# EAGLE schematic design_block_rev3.4 (EAGLE 9.3.0)
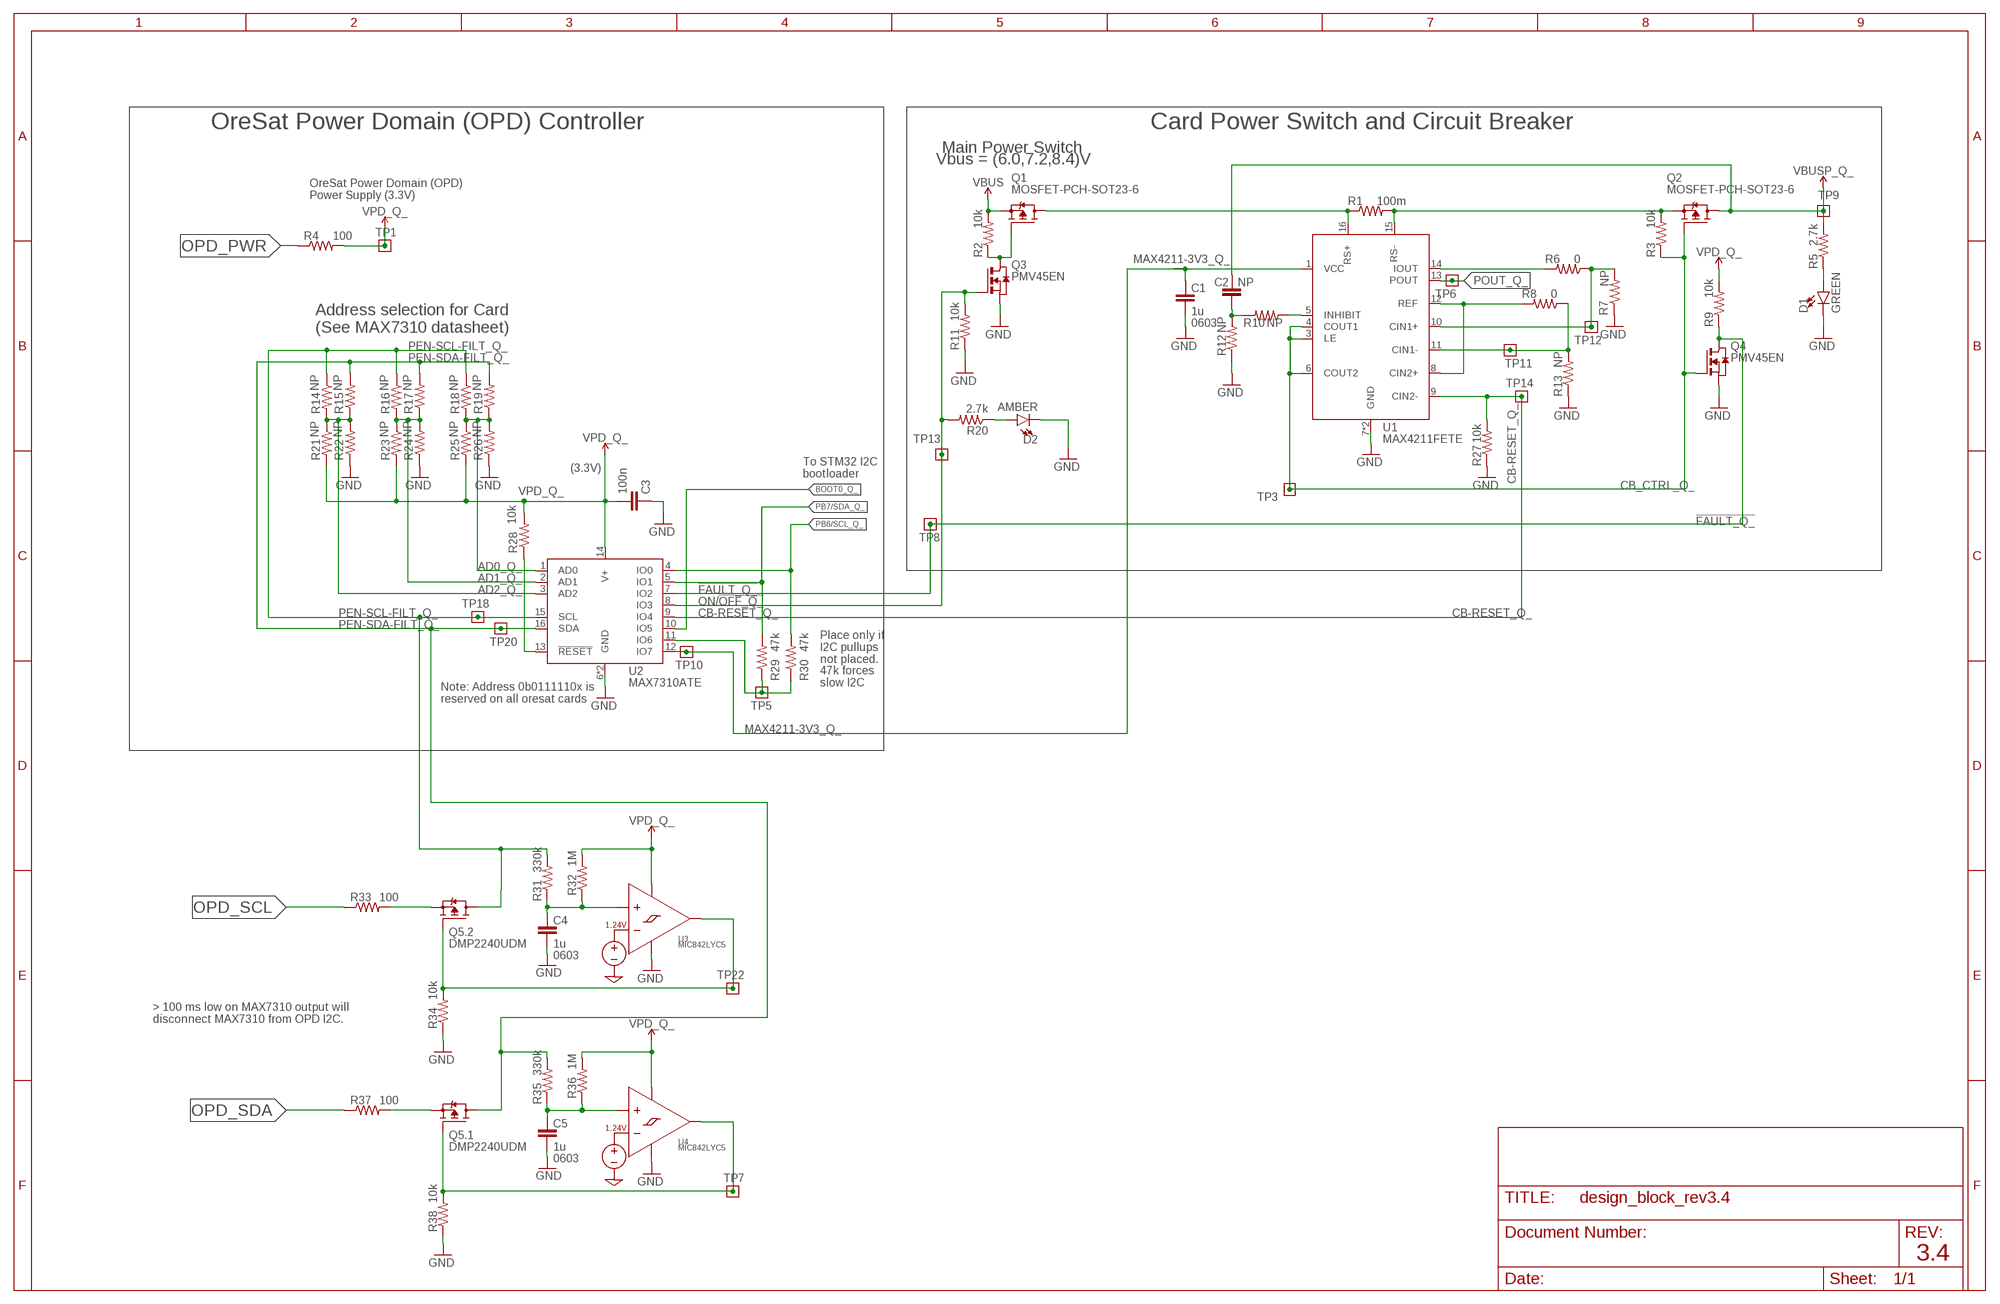
[diagram p0: schematic, sheet 1]

## Parts
C1  1u  C-EU0603-B-NOSILK  [.0603-B-NOSILK]
C2  NP  C-EU0402-B-NOSILK  [.0402-B-NOSILK]
C3  100n  C-EU0402-B-NOSILK  [.0402-B-NOSILK]
C4  1u  C-EU0603-B-NOSILK  [.0603-B-NOSILK]
C5  1u  C-EU0603-B-NOSILK  [.0603-B-NOSILK]
D1  GREEN  LED-GREEN0603  [LED-0603]
D2  AMBER  LED-GREEN0603  [LED-0603]
Q1  MOSFET-PCH-SOT23-6  [SOT23-6]
Q2  MOSFET-PCH-SOT23-6  [SOT23-6]
Q3  PMV45EN  [SOT23]
Q4  PMV45EN  [SOT23]
Q5  DMP2240UDM  MOSFET-PCH-SOT23-6  [SOT23-6]
R1  100m  R-US_R1206  [R1206]
R2  10k  R-US_0402-B-NOSILK  [.0402-B-NOSILK]
R3  10k  R-US_0402-B-NOSILK  [.0402-B-NOSILK]
R4  100  R-US_0402-B-NOSILK  [.0402-B-NOSILK]
R5  2.7k  R-US_0402-B-NOSILK  [.0402-B-NOSILK]
R6  0  R-US_0402-B-NOSILK  [.0402-B-NOSILK]
R7  NP  R-US_0402-B-NOSILK  [.0402-B-NOSILK]
R8  0  R-US_0402-B-NOSILK  [.0402-B-NOSILK]
R9  10k  R-US_0402-B-NOSILK  [.0402-B-NOSILK]
R10  NP  R-US_0402-B-NOSILK  [.0402-B-NOSILK]
R11  10k  R-US_0402-B-NOSILK  [.0402-B-NOSILK]
R12  NP  R-US_0402-B-NOSILK  [.0402-B-NOSILK]
R13  NP  R-US_0402-B-NOSILK  [.0402-B-NOSILK]
R14  NP  R-US_0402-B-NOSILK  [.0402-B-NOSILK]
R15  NP  R-US_0402-B-NOSILK  [.0402-B-NOSILK]
R16  NP  R-US_0402-B-NOSILK  [.0402-B-NOSILK]
R17  NP  R-US_0402-B-NOSILK  [.0402-B-NOSILK]
R18  NP  R-US_0402-B-NOSILK  [.0402-B-NOSILK]
R19  NP  R-US_0402-B-NOSILK  [.0402-B-NOSILK]
R20  2.7k  R-US_0402-B-NOSILK  [.0402-B-NOSILK]
R21  NP  R-US_0402-B-NOSILK  [.0402-B-NOSILK]
R22  NP  R-US_0402-B-NOSILK  [.0402-B-NOSILK]
R23  NP  R-US_0402-B-NOSILK  [.0402-B-NOSILK]
R24  NP  R-US_0402-B-NOSILK  [.0402-B-NOSILK]
R25  NP  R-US_0402-B-NOSILK  [.0402-B-NOSILK]
R26  NP  R-US_0402-B-NOSILK  [.0402-B-NOSILK]
R27  10k  R-US_0402-B-NOSILK  [.0402-B-NOSILK]
R28  10k  R-US_0402-B-NOSILK  [.0402-B-NOSILK]
R29  47k  R-US_0402-B-NOSILK  [.0402-B-NOSILK]
R30  47k  R-US_0402-B-NOSILK  [.0402-B-NOSILK]
R31  330k  R-US_0402-B-NOSILK  [.0402-B-NOSILK]
R32  1M  R-US_0402-B-NOSILK  [.0402-B-NOSILK]
R33  100  R-US_0402-B-NOSILK  [.0402-B-NOSILK]
R34  10k  R-US_0402-B-NOSILK  [.0402-B-NOSILK]
R35  330k  R-US_0402-B-NOSILK  [.0402-B-NOSILK]
R36  1M  R-US_0402-B-NOSILK  [.0402-B-NOSILK]
R37  100  R-US_0402-B-NOSILK  [.0402-B-NOSILK]
R38  10k  R-US_0402-B-NOSILK  [.0402-B-NOSILK]
TP1  TEST-POINT  [2MM-TEST-POINT]
TP3  TEST-POINT  [2MM-TEST-POINT]
TP5  TEST-POINT  [2MM-TEST-POINT]
TP6  TEST-POINT  [2MM-TEST-POINT]
TP7  TEST-POINT  [2MM-TEST-POINT]
TP8  TEST-POINT  [2MM-TEST-POINT]
TP9  TEST-POINT  [2MM-TEST-POINT]
TP10  TEST-POINT  [2MM-TEST-POINT]
TP11  TEST-POINT  [2MM-TEST-POINT]
TP12  TEST-POINT  [2MM-TEST-POINT]
TP13  TEST-POINT  [2MM-TEST-POINT]
TP14  TEST-POINT  [2MM-TEST-POINT]
TP18  TEST-POINT  [2MM-TEST-POINT]
TP20  TEST-POINT  [2MM-TEST-POINT]
TP22  TEST-POINT  [2MM-TEST-POINT]
U1  MAX4211FETE  MAX4211  [QFN65P400X400X80-17T210]
U2  MAX7310ATE  MAX7310  [QFN65P400X400X80-17T210]
U3  MIC842LYC5  [SC70-5]
U4  MIC842LYC5  [SC70-5]

## Nets
!FAULT_Q_: Q4.3(D) R9.1 TP8.1 U2.7(IO2)
AD0_Q_: R18.2 R19.1 R25.1 R26.2 U2.1(AD0)
AD1_Q_: R16.2 R17.1 R23.1 R24.2 U2.2(AD1)
AD2_Q_: R14.2 R15.1 R21.1 R22.2 U2.3(AD2)
BOOT0_Q_: U2.10(IO5)
CB-RESET_Q_: R27.2 TP14.1 U1.9(CIN2-) U2.9(IO4)
CB_CTRL_Q_: Q2.3(G) Q4.1(G) R3.1 TP3.1 U1.3(LE) U1.4(COUT1) U1.6(COUT2)
GND: C1.2 C3.1 C4.2 C5.2 D1.C D2.C Q3.2(S) Q4.2(S) R7.1 R11.1 R12.1 R13.1 R22.1 R24.1 R26.1 R27.1 R34.1 R38.1 U1.7(GND) U1.EPAD(GND) U2.6(GND) U2.EPAD(GND) U3.2(GND) U4.2(GND)
IOUT_Q_: R6.2 U1.14(IOUT)
MAX4211-3V3_Q_: C1.1 TP10.1 U1.1(VCC) U2.12(IO7)
N$270: D1.A R5.1
N$385: R29.1 R30.1 TP5.1 U2.11(IO6)
N$398: Q2.4(S) R1.2 R3.2 U1.15(RS-)
N$400: C4.1 R31.1 R32.1 U3.1(INP)
N$401: C5.1 R35.1 R36.1 U4.1(INP)
N$479: Q5.2(.2:S) R33.2
N$480: Q5.3(.2:G) R34.2 TP22.1 U3.4(OUT)
N$575: D2.A R20.1
N$579: Q5.5(.1:S) R37.2
N$580: Q5.1(.1:G) R38.2 TP7.1 U4.4(OUT)
N$589: R28.1 U2.13(!RESET)
N$590: Q1.3(G) Q3.3(D) R2.1
N$593: Q1.1(D) Q1.2(D) Q1.5(D) Q1.6(D) R1.1 U1.16(RS+)
N$596: R6.1 R7.2 TP12.1 U1.10(CIN1+)
N$597: R8.1 R13.2 TP11.1 U1.11(CIN1-)
N$599: R8.2 U1.8(CIN2+) U1.12(REF)
N$603: C2.1 R10.2 R12.2
N$604: R10.1 U1.5(INHIBIT)
ON/!OFF_Q_: Q3.1(G) R11.2 R20.2 TP13.1 U2.8(IO3)
OPD_PWR: R4.1
OPD_SCL: R33.1
OPD_SDA: R37.1
PB6/SCL_Q_: R30.2 U2.4(IO0)
PB7/SDA_Q_: R29.2 U2.5(IO1)
PEN-SCL-FILT_Q_: Q5.4(.2:D) R14.1 R16.1 R18.1 R31.2 TP18.1 U2.15(SCL)
PEN-SDA-FILT_Q_: Q5.6(.1:D) R15.2 R17.2 R19.2 R35.2 TP20.1 U2.16(SDA)
POUT_Q_: TP6.1 U1.13(POUT)
VBUS: Q1.4(S) R2.2
VBUSP_Q_: C2.2 Q2.1(D) Q2.2(D) Q2.5(D) Q2.6(D) R5.2 TP9.1
VPD_Q_: C3.2 R4.2 R9.2 R21.2 R23.2 R25.2 R28.2 R32.2 R36.2 TP1.1 U2.14(V+) U3.5(VDD) U4.5(VDD)

## Notes on the sheet
- OreSat Power Domain (OPD) Controller | Card Power Switch and Circuit Breaker
- Main Power Switch
- Vbus = (6.0,7.2,8.4)V
- OreSat Power Domain (OPD)
  Power Supply (3.3V)
- 0603
- Address selection for Card
  (See MAX7310 datasheet)
- (3.3V)
- To STM32 I2C
  bootloader
- Place only if
  I2C pullups
  not placed.
- 47k forces
  slow I2C
- Note: Address 0b0111110x is 
  reserved on all oresat cards
- 0603
- > 100 ms low on MAX7310 output will
  disconnect MAX7310 from OPD I2C.
- 0603
- 3.4

## Library data of the parts
C1 C4 C5 = oresat-rcl:C-EU: CAPACITOR, European symbol; DIS: Digi-Key; DPN: 311-1446-1-ND; MFR: Yageo; MPN: CC0603KRX7R7BB105
C2 = rcl_custom:C-EU: CAPACITOR, European symbol
C3 = rcl_custom:C-EU: CAPACITOR, European symbol; DIS: Digi-Key; DPN: 1276-1001-1-ND; MFR: Samsung; MPN: CL05B104KO5NNNC
D1 = SparkFun-LED:LED-GREEN: Green SMD LED Used in manufacturing of various products at SparkFun Packages: 0603 - SMD 0603 package [Product Link] <http://www.futureelectronics.com/en/technologies/semiconductors/optoelectronics/leds/Pages/9894312-LTST-C190GKT.aspx?CrossPart=HSMG-C190&IM=0> LilyPad 1206 - SMD1206 LilyPad package [Product Link] <http://www.futureelectronics.com/en/Technologies/Product.aspx?ProductID=IN150NGHARVATEKCORPORATION2049943&IM=0> 1206 - SMD1206 package [Product Link] <http://www.futureelectronics.com/en/technologies/semiconductors/optoelectronics/leds/Pages/8315665-LTST-C150KGKT.aspx?IM=0> 1206 Bottom Mount -SMD 1206 Bottom Mount [Product Link] <http://www.digikey.com/product-detail/en/lite-on-inc/LTST-C230KGKT/160-1456-1-ND/386854> SparkFun Products: Pro Mini 328 -5V <https://www.sparkfun.com/products/821> RedBoard <https://www.sparkfun.com/products/12757> MP3 Trigger <https://www.sparkfun.com/products/13720> Makey Makey <https://www.sparkfun.com/products/11076>; DIS: Digi-Key; DPN: 511-1584-1-ND; MFR: Rohm; MPN: SML-E12M8WT86
D2 = SparkFun-LED:LED-GREEN: Green SMD LED Used in manufacturing of various products at SparkFun Packages: 0603 - SMD 0603 package [Product Link] <http://www.futureelectronics.com/en/technologies/semiconductors/optoelectronics/leds/Pages/9894312-LTST-C190GKT.aspx?CrossPart=HSMG-C190&IM=0> LilyPad 1206 - SMD1206 LilyPad package [Product Link] <http://www.futureelectronics.com/en/Technologies/Product.aspx?ProductID=IN150NGHARVATEKCORPORATION2049943&IM=0> 1206 - SMD1206 package [Product Link] <http://www.futureelectronics.com/en/technologies/semiconductors/optoelectronics/leds/Pages/8315665-LTST-C150KGKT.aspx?IM=0> 1206 Bottom Mount -SMD 1206 Bottom Mount [Product Link] <http://www.digikey.com/product-detail/en/lite-on-inc/LTST-C230KGKT/160-1456-1-ND/386854> SparkFun Products: Pro Mini 328 -5V <https://www.sparkfun.com/products/821> RedBoard <https://www.sparkfun.com/products/12757> MP3 Trigger <https://www.sparkfun.com/products/13720> Makey Makey <https://www.sparkfun.com/products/11076>; DIS: Digi-Key; DPN: 1830-1064-1-ND; MFR: Inolux; MPN: IN-S63AT5A; VALUE: GREEN
Q1 Q2 = Q-MOSFET-PCH-SOT23-6:MOSFET-PCH-SOT23-6: P channel MOSFET in an SOT23-6; DIS: Digi-Key; DPN: DMP3050LVT-7DICT-ND; MFR: Diodes Inc; MPN: DMP3050LVT-7
Q3 Q4 = Tova:PMV45EN; DIS: Digi-Key; DPN: 1727-2307-1-ND; MFR: Nexperia; MPN: PMV45EN2R
Q5 = Q-MOSFET-PCH-dual-SOT23-6:MOSFET-PCH-SOT23-6: Dual P channel MOSFETs in an SOT23-6; DIS: Digi-Key; DPN: DMP2240UDMDICT-ND; MFR: Diodes Inc; MPN: DMP2240UDM
R1 = rcl:R-US_: RESISTOR, American symbol; DIS: Digi-Key; DPN: CSR1206FTR100CT-ND; MFR: Stackpole; MPN: CSR1206FTR100; SPICEPREFIX: R
R2 R3 R9 R11 R27 R28 R34 R38 = rcl_custom:R-US_: RESISTOR, American symbol; DIS: Digi-Key; DPN: 311-10.0KLRCT-ND; MFR: Yageo; MPN: RC0402FR-0710KL
R4 R33 R37 = rcl_custom:R-US_: RESISTOR, American symbol; DIS: Digi-Key; DPN: 311-100LRCT-ND; MFR: Yageo; MPN: RC0402FR-07100RL
R5 R20 = rcl_custom:R-US_: RESISTOR, American symbol; DIS: Digi-Key; DPN: A129632CT-ND; MFR: TE Connectivity; MPN: CRGCQ0402F2K7
R6 R8 = rcl_custom:R-US_: RESISTOR, American symbol; DIS: Digi-Key; DPN: 311-0.0JRCT-ND; MFR: Yageo; MPN: RC0402JR-070RL
R7 R10 R12-R19 R21-R26 = rcl_custom:R-US_: RESISTOR, American symbol; DIS: Digi-Key; DPN: 1276-4275-1-ND; MFR: Samsung; MPN: RC1005F6653CS
R29 R30 = rcl_custom:R-US_: RESISTOR, American symbol; DIS: Digi-Key; DPN: 311-47.0KLRCT-ND; MFR: Yageo; MPN: RC0402FR-0747KL
R31 R35 = rcl_custom:R-US_: RESISTOR, American symbol; DIS: Digi-Key; DPN: 749-1575-1-ND; MFR: Vishay; MPN: MCS04020C3303FE000
R32 R36 = rcl_custom:R-US_: RESISTOR, American symbol; DIS: Digi-Key; DPN: 311-1.00MLRCT-ND; MFR: Yageo; MPN: RC0402FR-071ML
TP1 TP3 TP5-TP14 TP18 TP20 TP22 = Tova:TEST-POINT
U1 = U-Maxim-MAX4211-power-monitor:MAX4211; DIS: Digi-Key; DPN: MAX4211FETE+-ND; MFR: Maxim; MPN: MAX4211FETE
U2 = U-Maxim-MAX7310-I2C-GPIO-expander:MAX7310; DIS: Digi-Key; DPN: MAX7310ATE+-ND; MFR: Maxim; MPN: MAX7310ATE
U3 U4 = U-Microchip-MIC842-Comparator:MIC842L